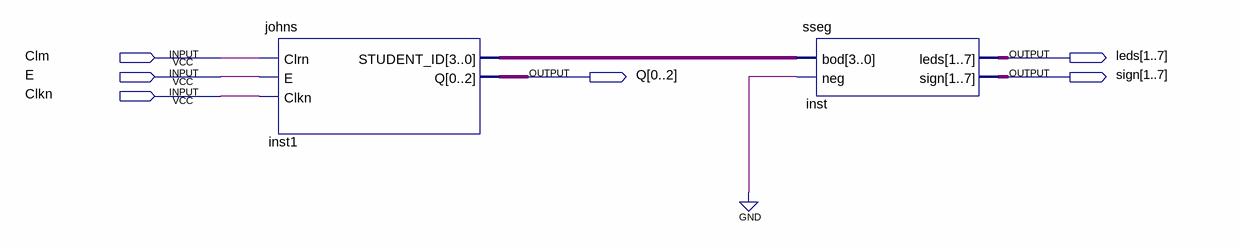
[diagram p0: schematic sheet]
// Quartus schematic JonhsBlock.bdf as structural Verilog: 2 symbols, 6 pins
module JonhsBlock (
  input  Clm,
  input  E,
  input  Clkn,
  output [1:7] leds,
  output [0:2] Q,
  output [1:7] sign
);

  wire [3:0] inst1_student_id;

  johns inst1 (.Clrn(Clm), .E(E), .Clkn(Clkn), .STUDENT_ID(inst1_student_id), .Q(Q));
  sseg inst (.bod(inst1_student_id), .neg(1'b0), .leds(leds), .sign(sign));
endmodule
